# EasyEDA schematic SCH_OPLL+PSG MegaMod_2021-11-04.json

## Sheets
1 OPLL: TITLE: Sheet_1; REV: 1.0; Date: 2021-10-31; Sheet: 1/1; Drawn By: Denjhang; Company: Your Company
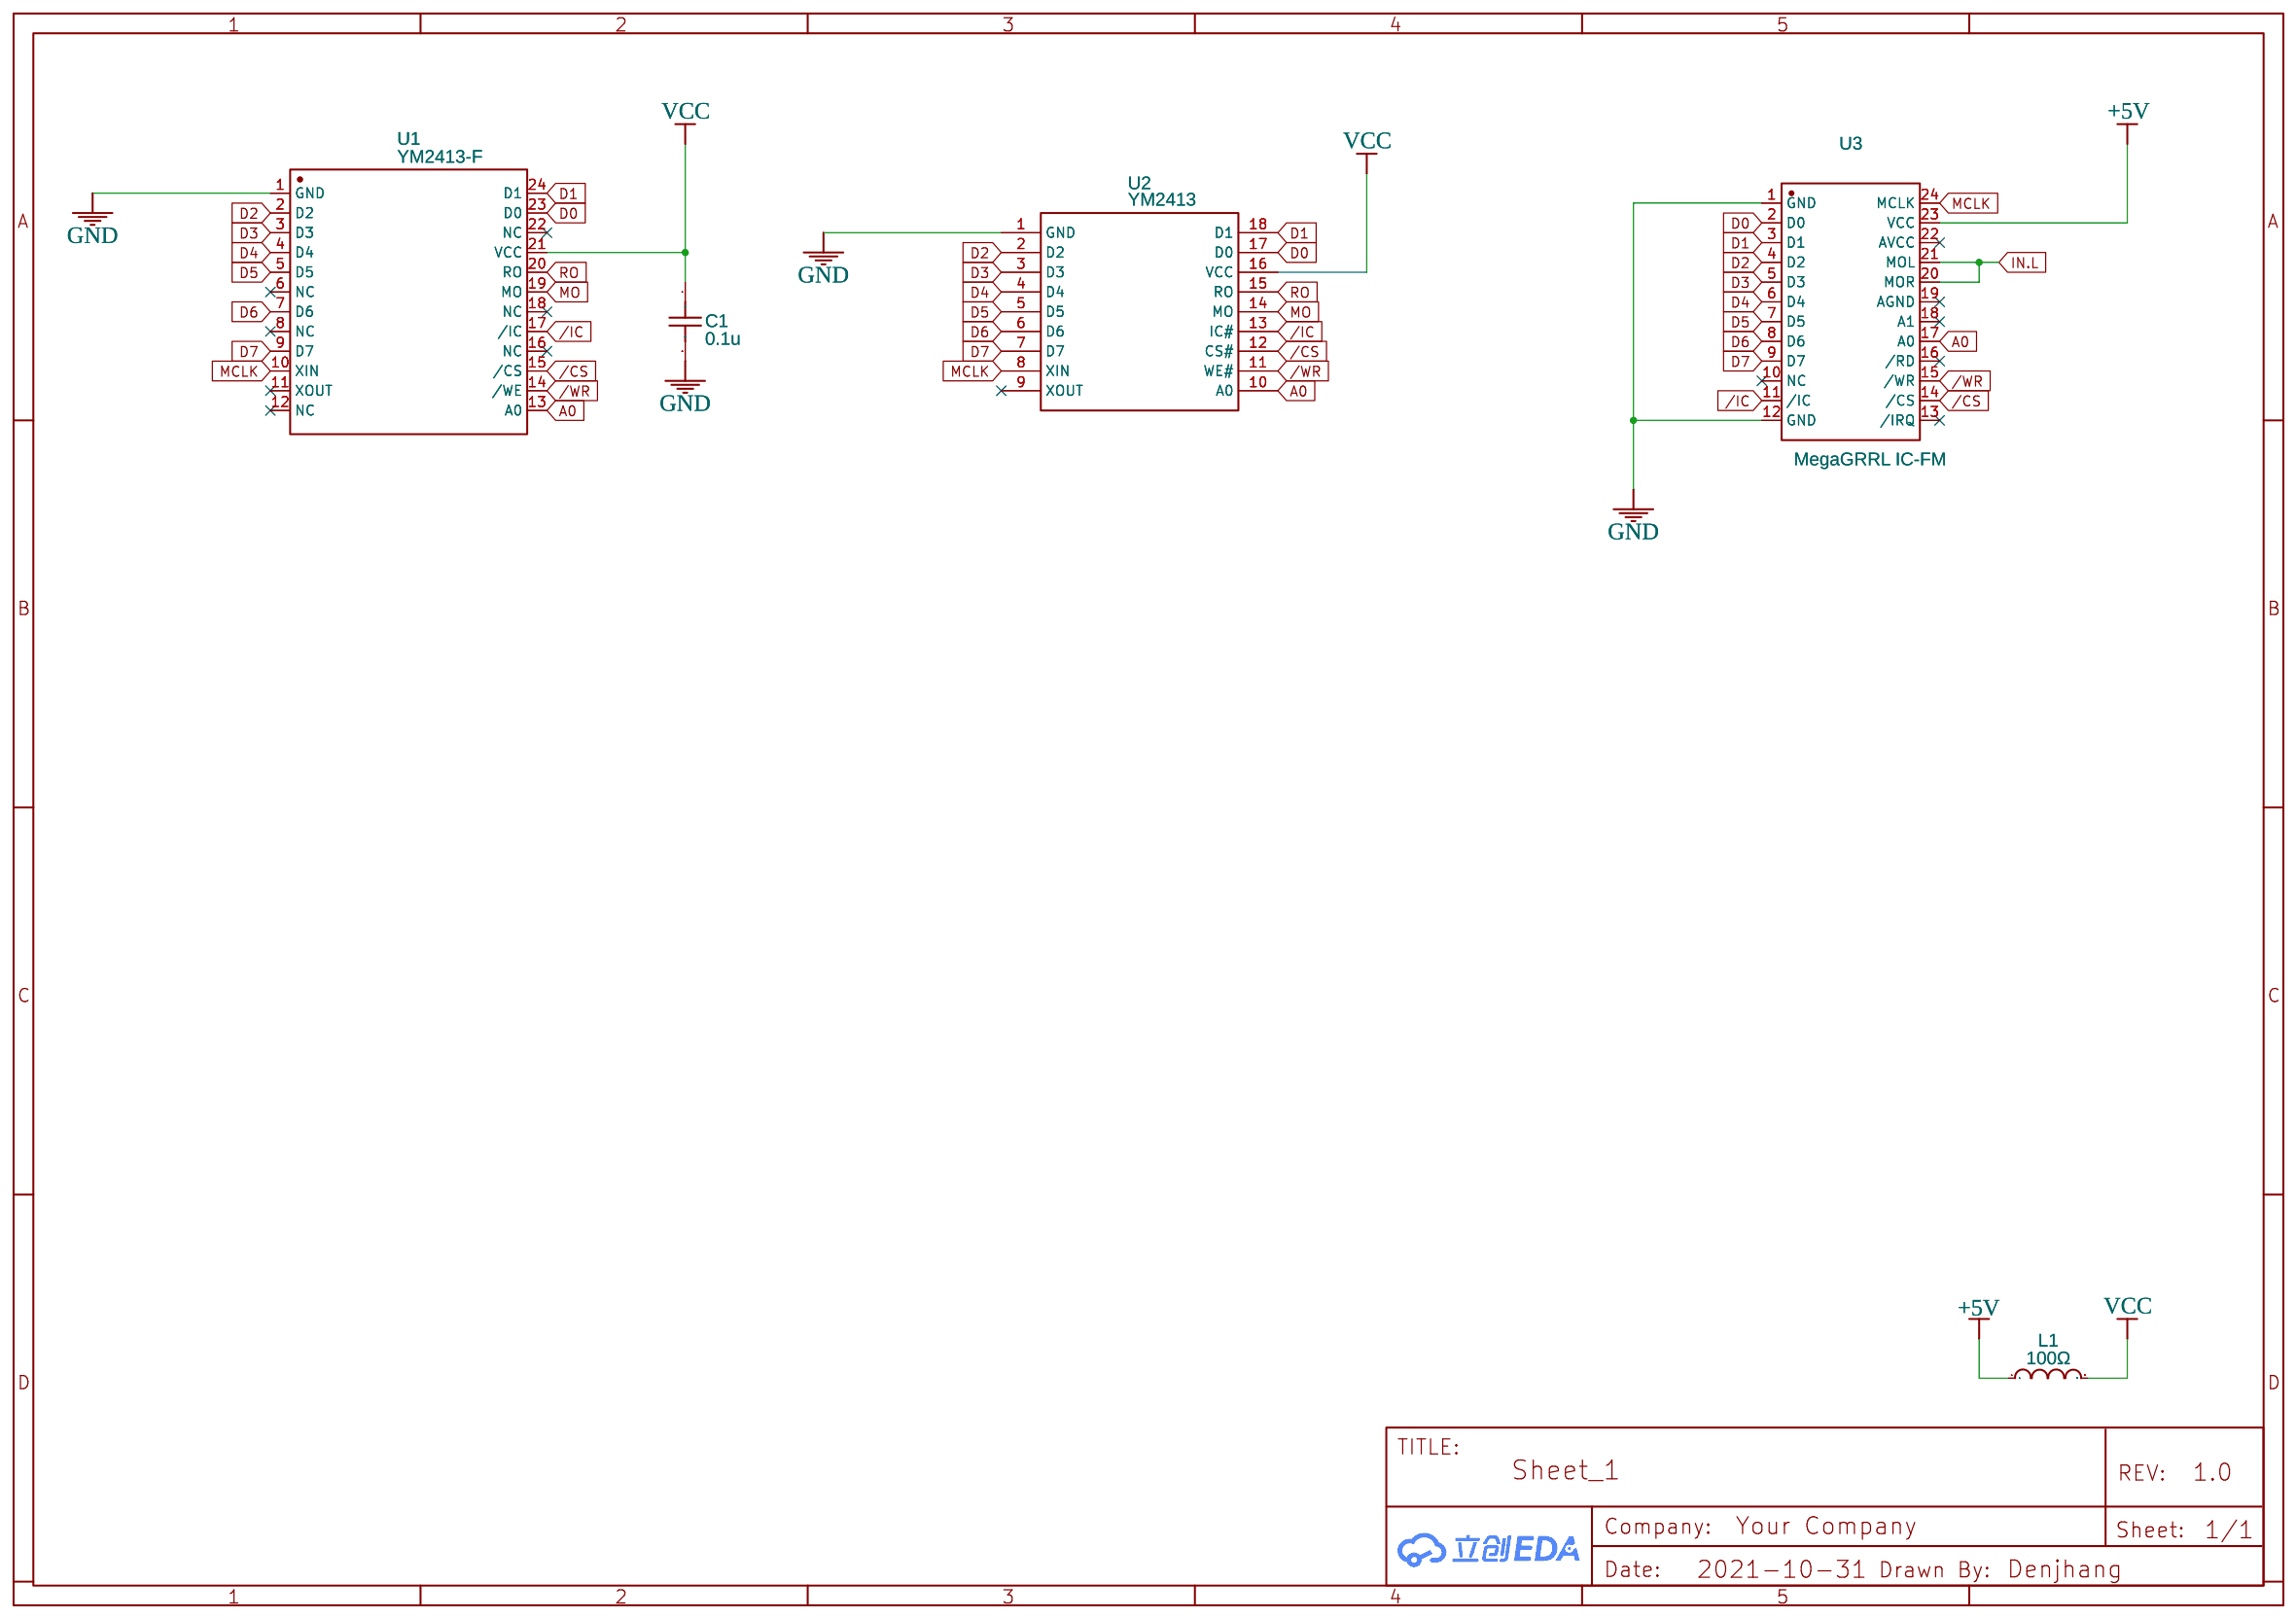
[diagram p0: OPLL]
2 PSG
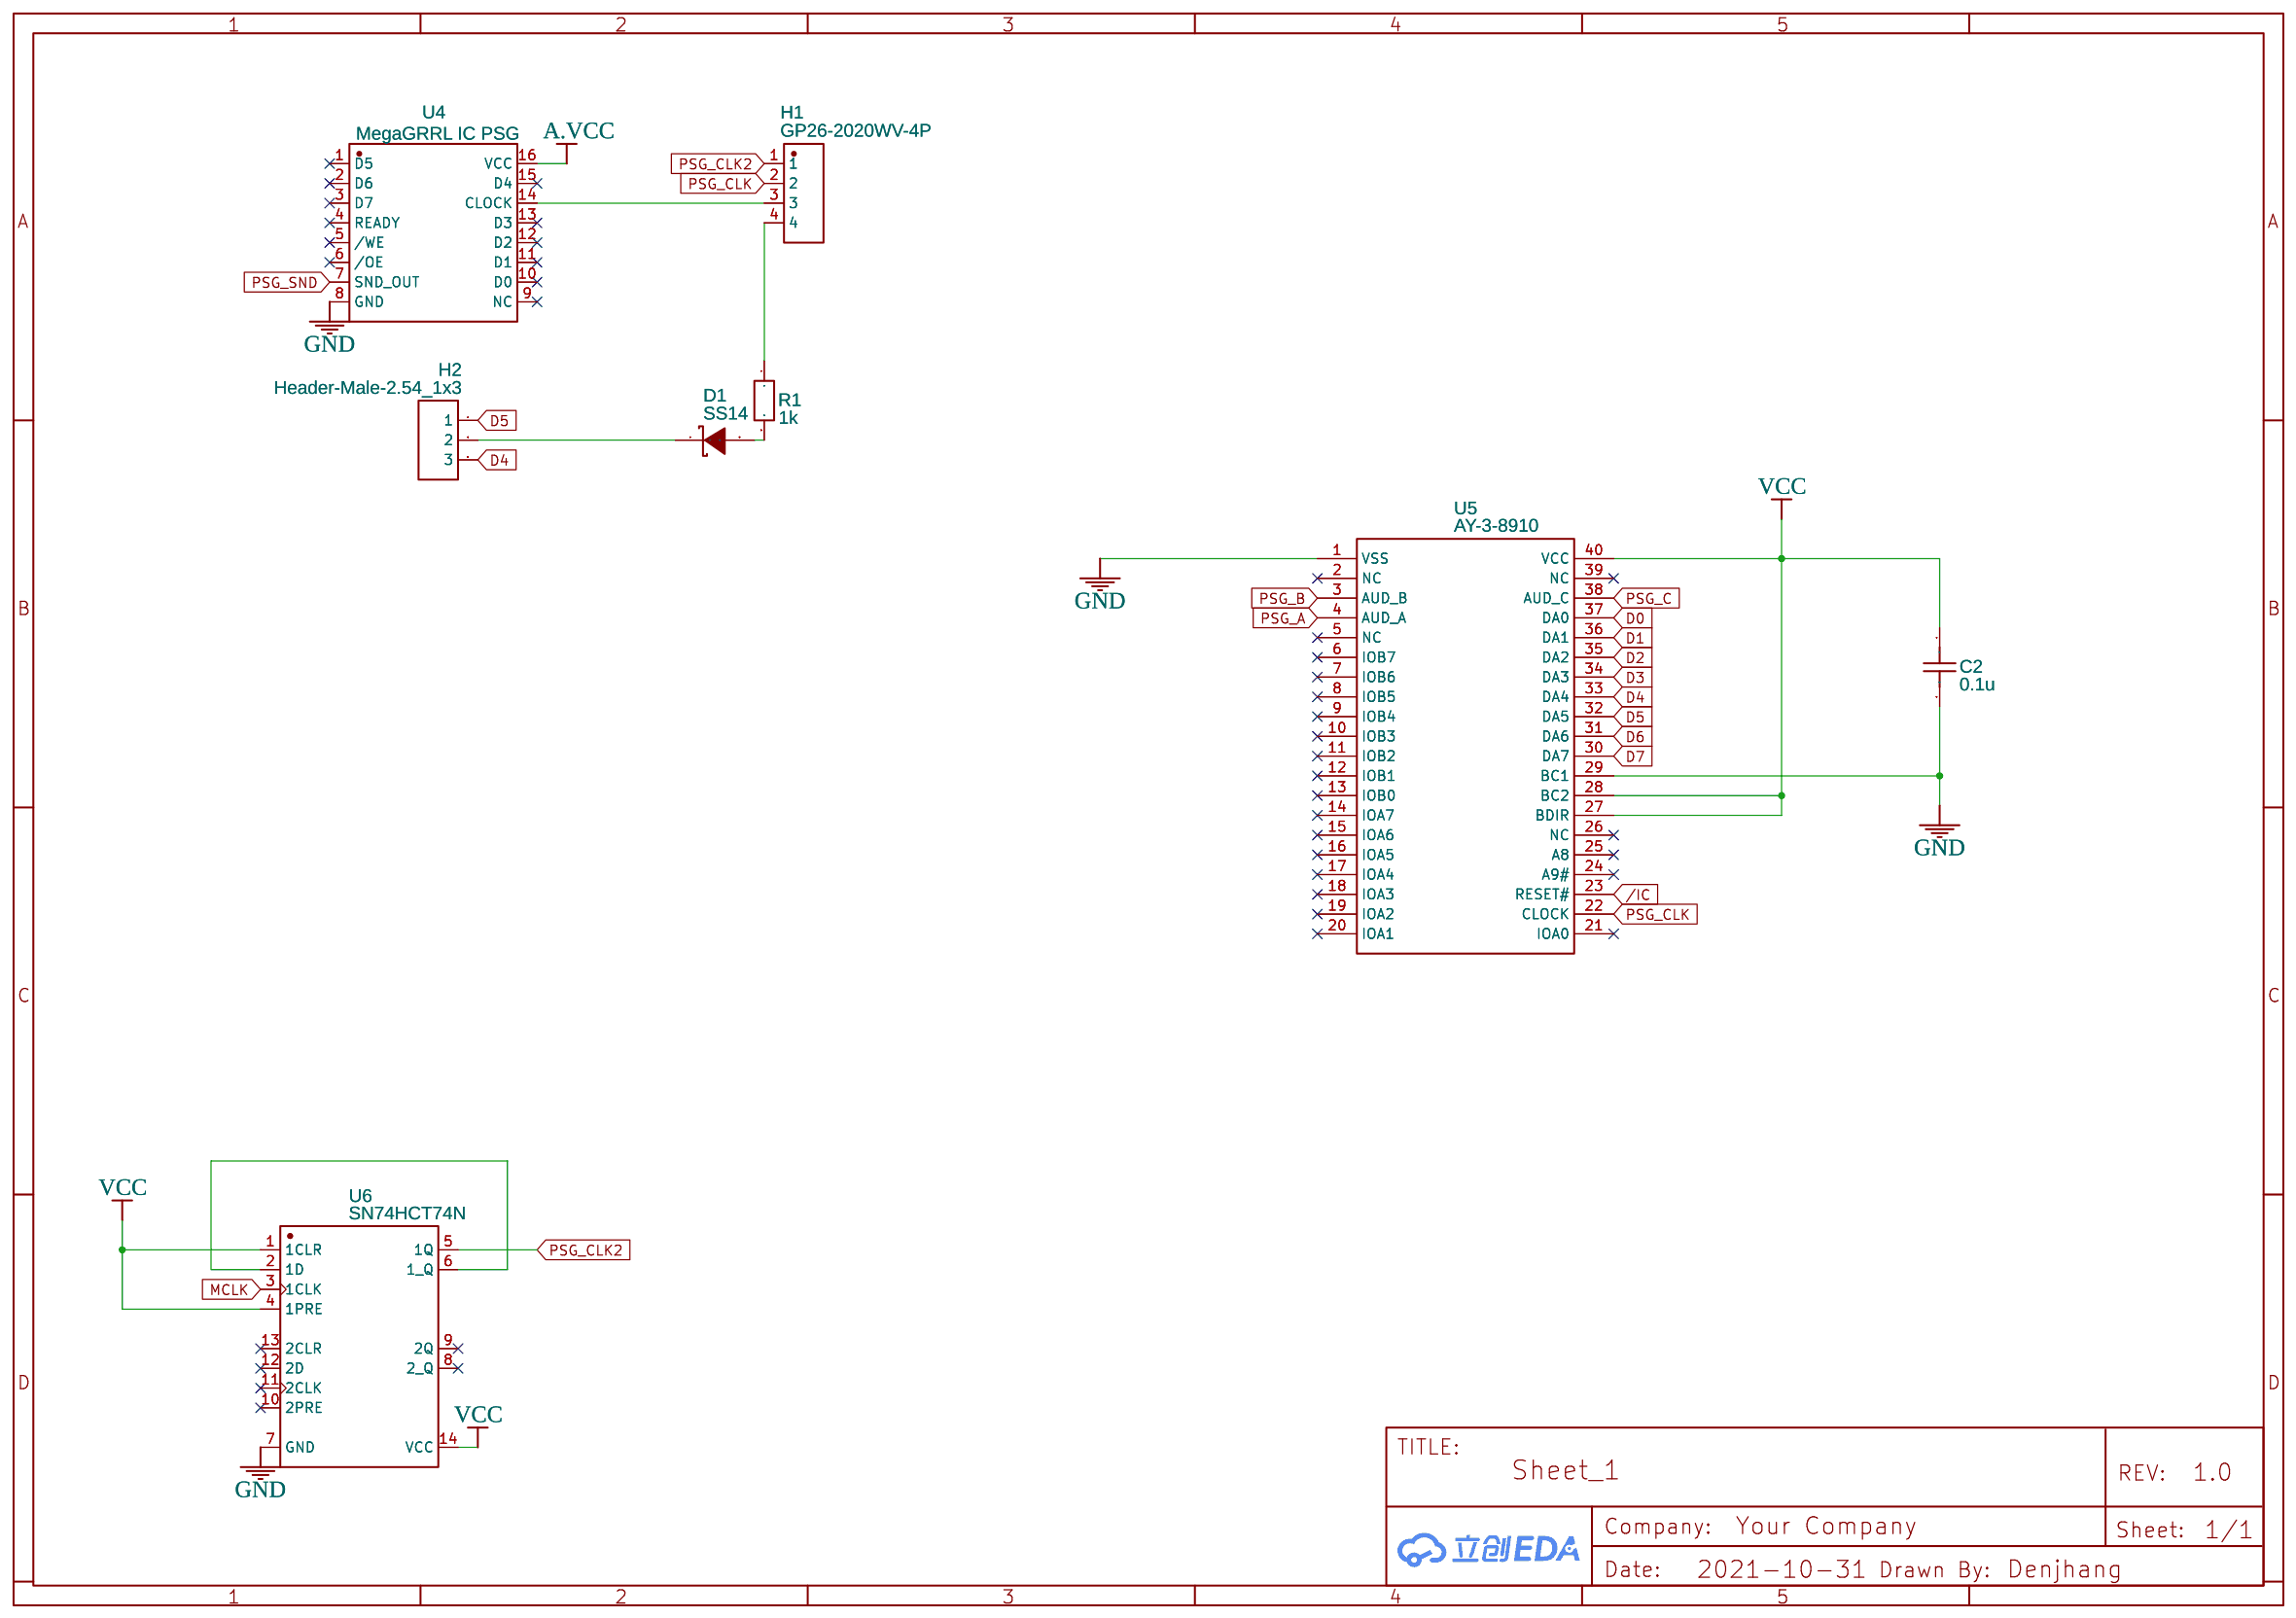
[diagram p1: PSG]
3 AY-Stereo: Date: 2021-11-02
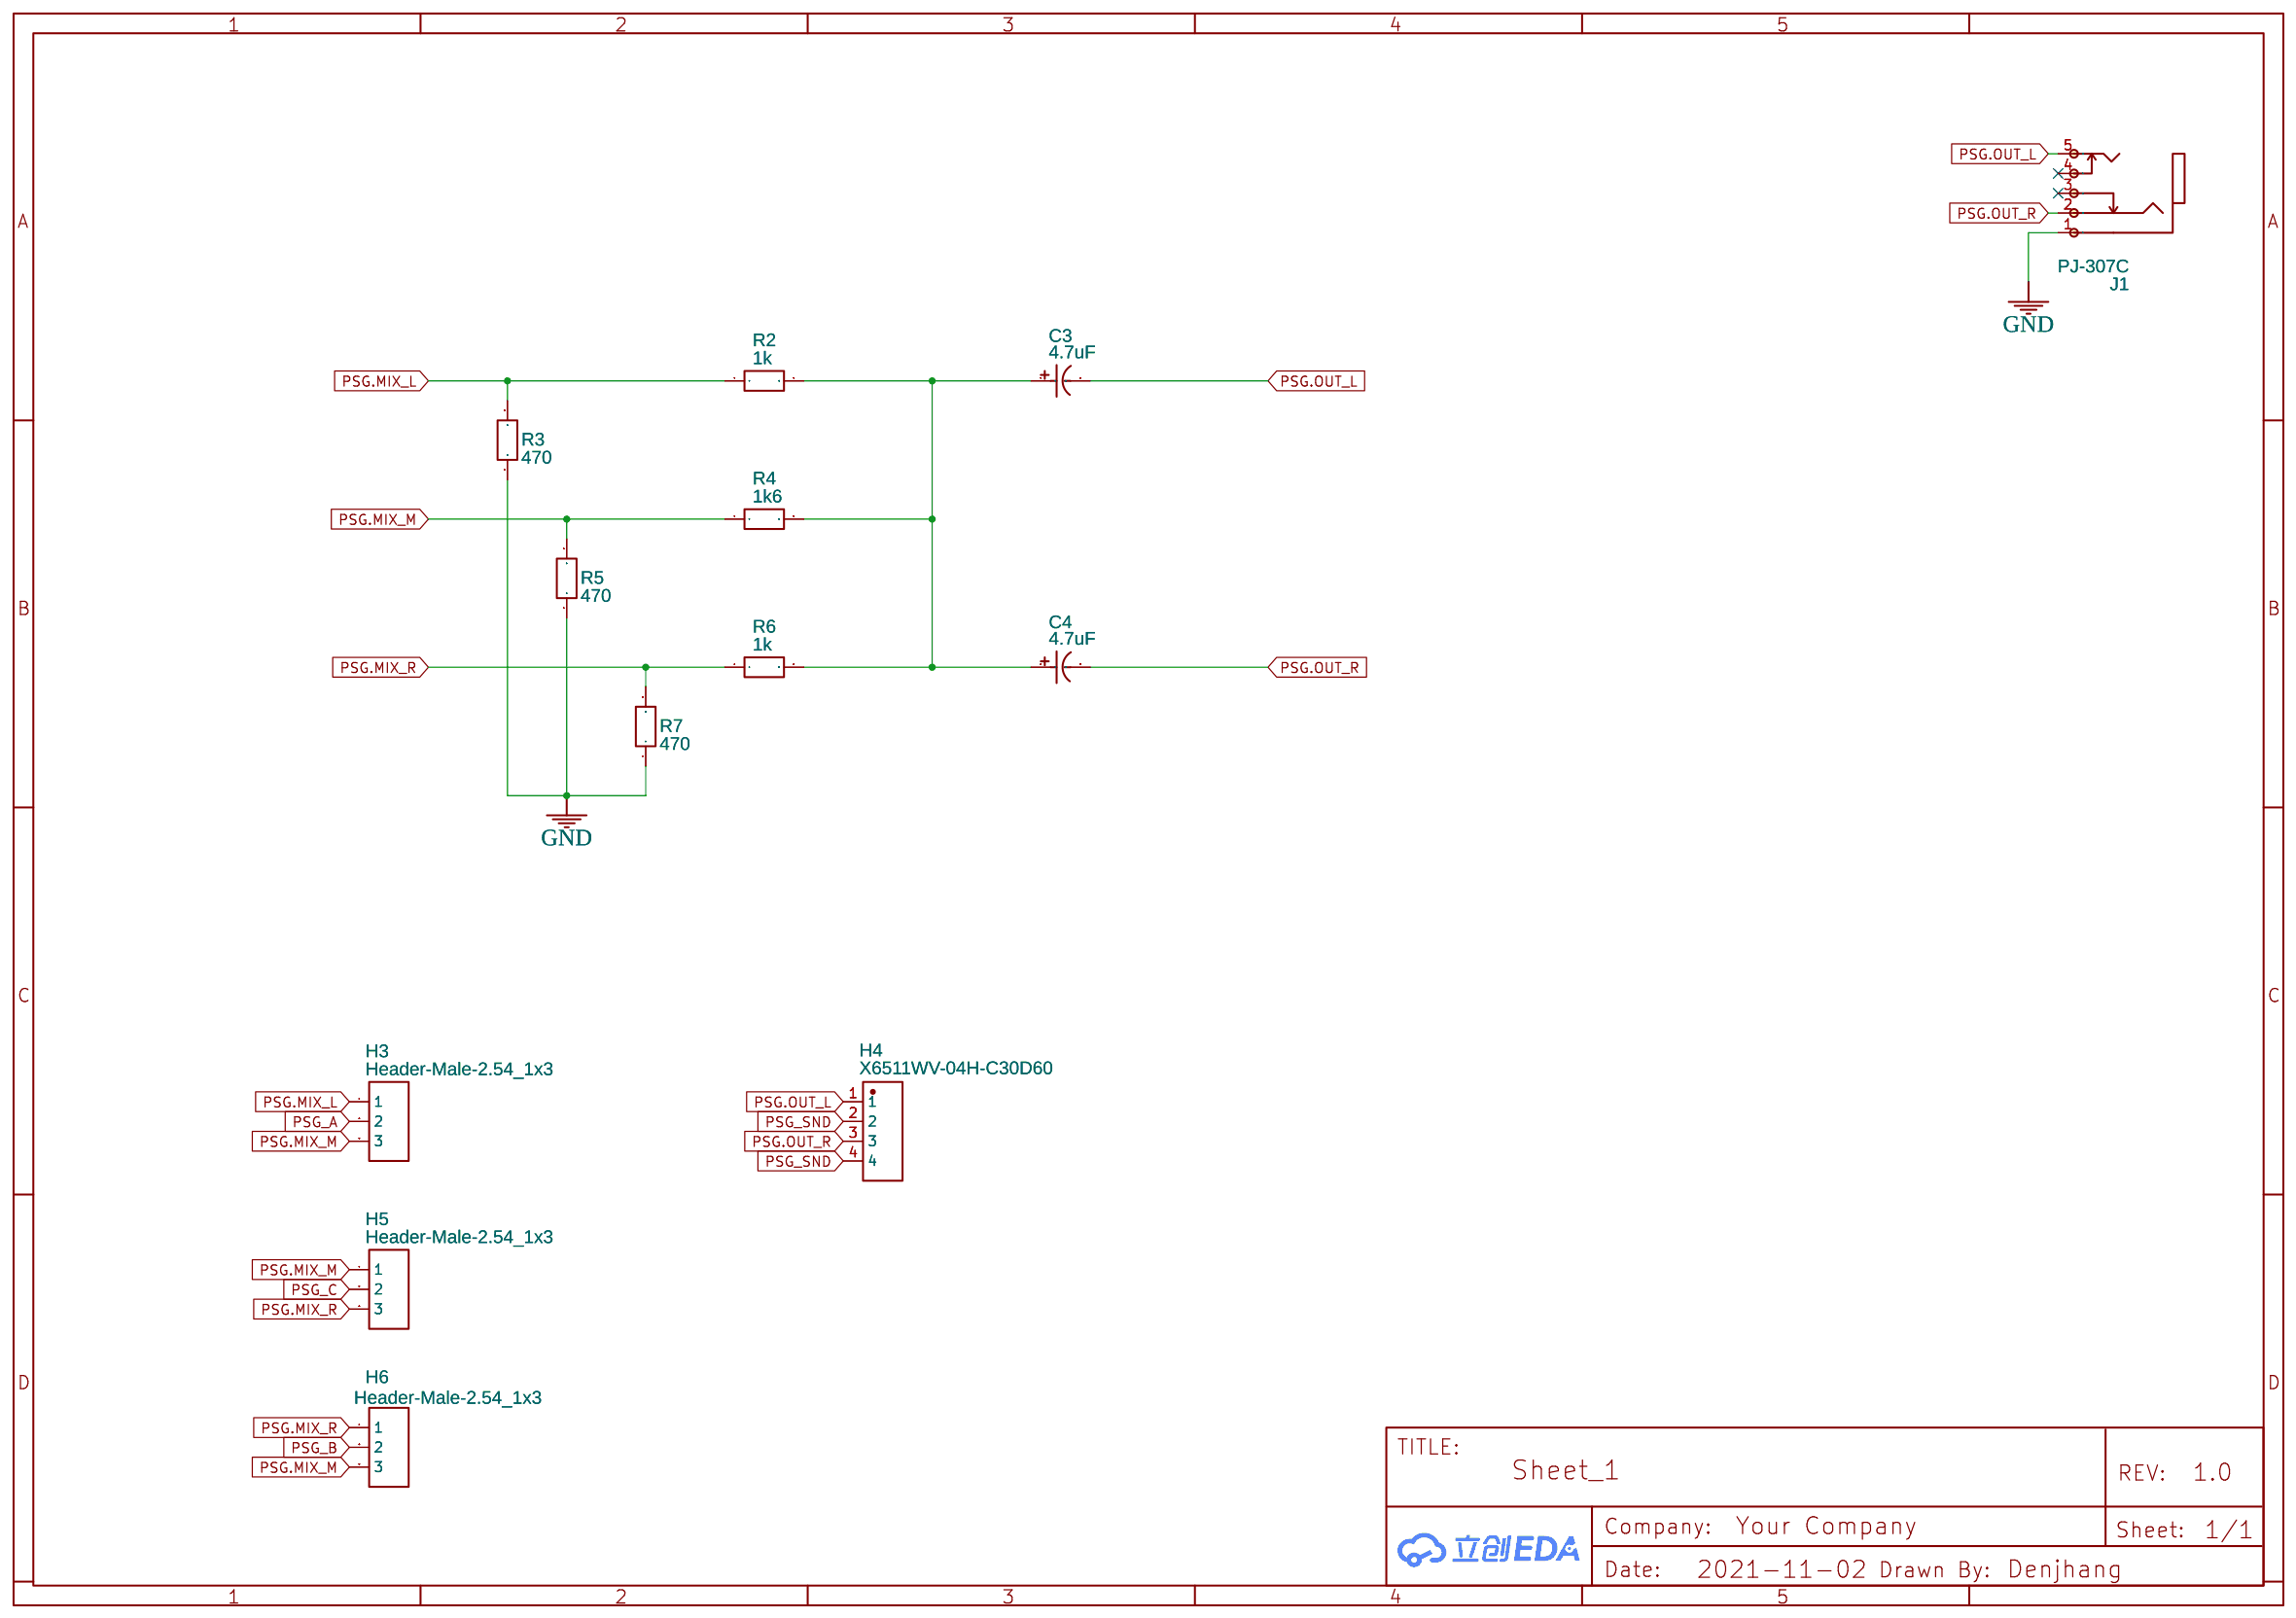
[diagram p2: AY-Stereo]
4 FM_AMP: Date: 2021-11-04
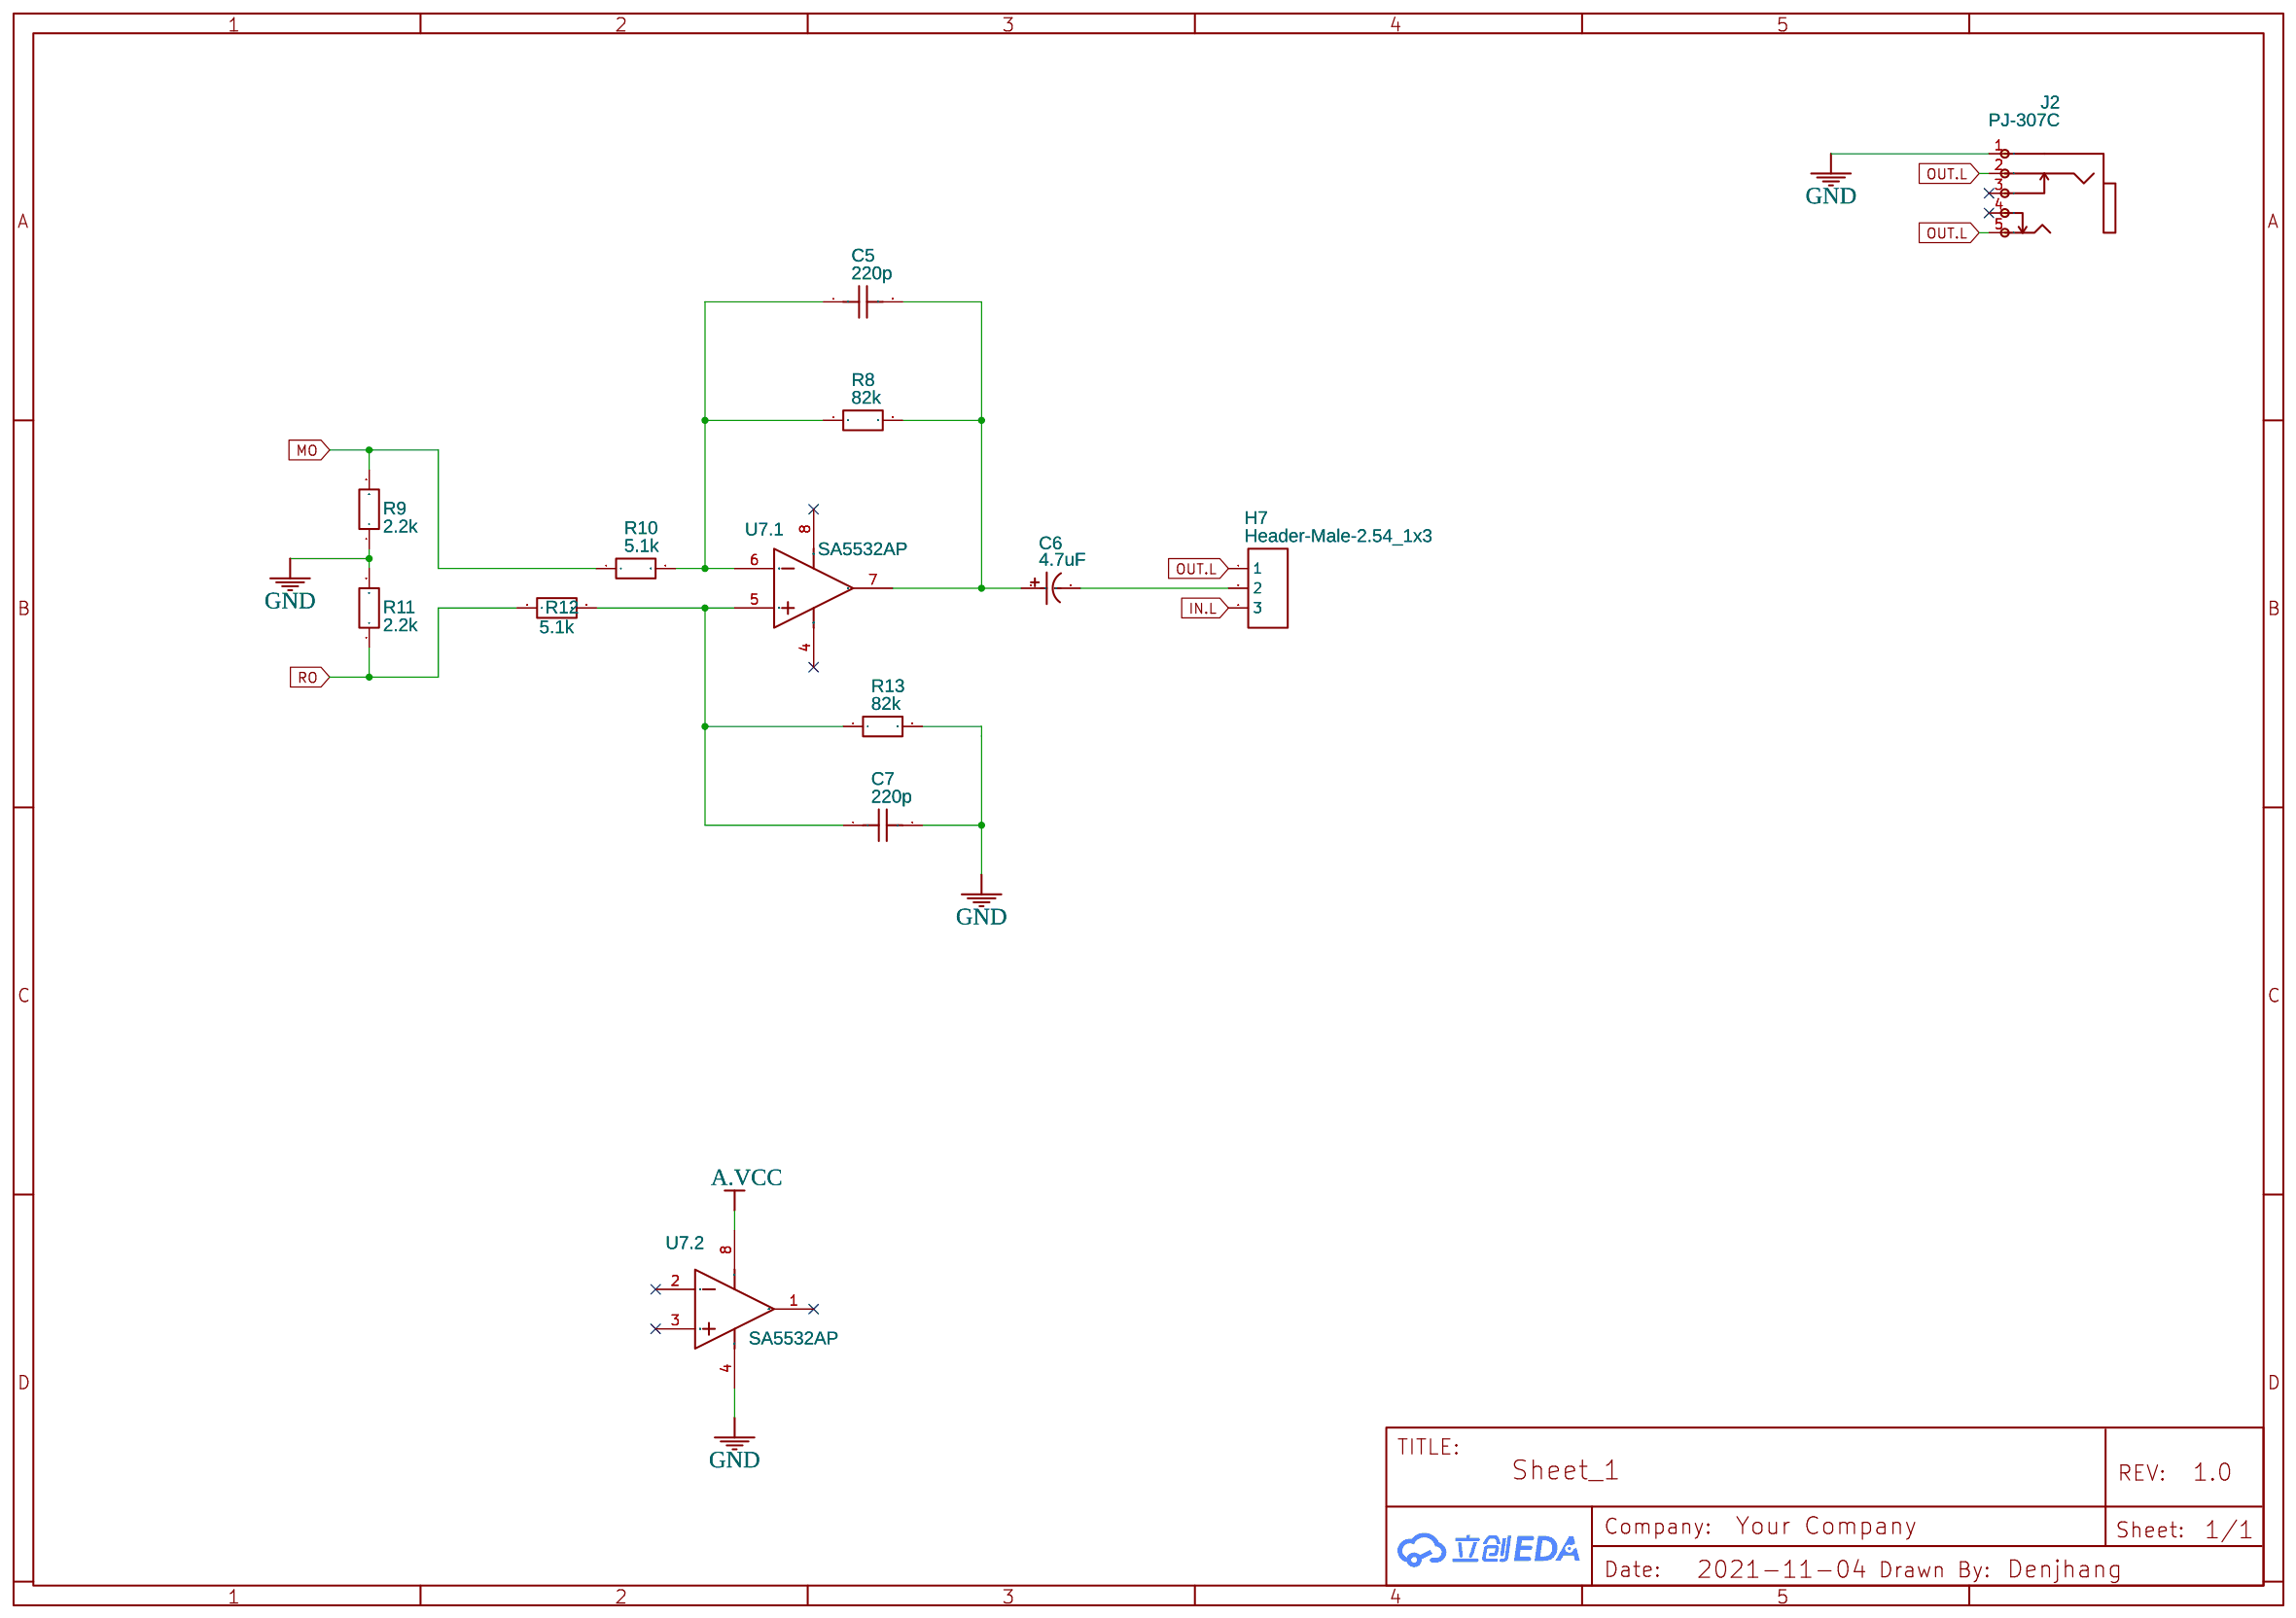
[diagram p3: FM_AMP]

## Parts
sheet AY-Stereo
C3  4.7uF  [CAP-TH_BD6.3-P2.50-D1.0-FD]
C4  4.7uF  [CAP-TH_BD6.3-P2.50-D1.0-FD]
H3  Header-Male-2.54_1x3  [HDR-TH_3P-P2.54-V-M-1]
H4  X6511WV-04H-C30D60  [HDR-TH_4P-P2.54-V-M]
H5  Header-Male-2.54_1x3  [HDR-TH_3P-P2.54-V-M-1]
H6  Header-Male-2.54_1x3  [HDR-TH_3P-P2.54-V-M-1]
J1  PJ-307C  [AUDIO-TH_PJ307C]
R2  1k  [R0603]
R3  470  [R0603]
R4  1k6  [R0603]
R5  470  [R0603]
R6  1k  [R0603]
R7  470  [R0603]
sheet FM_AMP
C5  220p  [C0603]
C6  4.7uF  [CAP-TH_BD6.3-P2.50-D1.0-FD]
C7  220p  [C0603]
H7  Header-Male-2.54_1x3  [HDR-TH_3P-P2.54-V-M-1]
J2  PJ-307C  [AUDIO-TH_PJ307C]
R8  82k  [R0603]
R9  2.2k  [R0603]
R10  5.1k  [R0603]
R11  2.2k  [R0603]
R12  5.1k  [R0603]
R13  82k  [R0603]
U7  SA5532AP  [DIP8]  (sections 1,2)
sheet OPLL
C1  0.1u  [C0603]
L1  100Ω  [L0603]
U1  YM2413-F  [SOIC24-YMF276]
U2  YM2413  [DIP-18_L23.0-W6.5-P2.54-LS7.6-BL]
U3  MegaGRRL IC-FM  [DIP-24_L32.0-W13.8-P2.54-LS15.6-BL]
sheet PSG
C2  0.1u  [C0603]
D1  SS14  [SMA_L4.4-W2.8-LS5.4-RD]
H1  GP26-2020WV-4P  [HDR-TH_4P-P2.00-V-M]
H2  Header-Male-2.54_1x3  [HDR-TH_3P-P2.54-V-M-1]
R1  1k  [R0603]
U4  MegaGRRL IC PSG  [DIP-16_L20.3-W10.2-P2.54-LS10.2-BL]
U5  AY-3-8910  [DIP-40_L52.0-W13.7-P2.54-LS15.2-BL]
U6  SN74HCT74N  [DIP-14]

## Library data of the parts
C3 C4 C6 = 25V 47uF: Supplier: LCSC; Manufacturer: ValuePro; Manufacturer Part: 电解电容25V 47uF; Supplier Part: C45704; JLCPCB Part Class: Extended Part
H2 H3 H5-H7 = Header-Male-2.54_1x3: Supplier: LCSC; Manufacturer: BOOMELE; Manufacturer Part: Header2.54mm 1*3P; Supplier Part: C49257; JLCPCB Part Class: Extended Part
H4 = X6511WV-04H-C30D60: Supplier: LCSC; Supplier Part: C706876; Manufacturer: XKB Connectivity; Contributor: LCSC; JLCPCB Part Class: Extended Part
J1 J2 = PJ-307C: Supplier: LCSC; Manufacturer: BOOMELE; Supplier Part: C16684; JLCPCB Part Class: Extended Part
R1-R13 = R_0603_EU: Contributor: LCEDA_Lib
C1 C2 C5 C7 = C_0603_US: Contributor: LCEDA_Lib
U7 = SA5532AP: Dual Low-Noise Operational Amplifier, 10 to 30 V, -40 to 85 degC, 8-pin DIP (P8), Pb-Free (RoHS); subpart_no: 1
L1 = CBW160808U102T: Supplier: LCSC; Manufacturer: FH; Supplier Part: C50069; JLCPCB Part Class: Extended Part
U1 = YM2413-F: Contributor: Denjhang
U2 = YM2413: Manufacturer: YAMAHA; Contributor: SudoMaker
U3 = MegaGRRL IC-FM: Supplier Part: C707077; Manufacturer: YAMAHA; Manufacturer Part: YM2612; Contributor: Denjhang; JLCPCB SMD: Yes; SMT Type: Extend
D1 = SS14: Supplier: LCSC; Manufacturer: MDD; Supplier Part: C2480; JLCPCB Part Class: Basic Part
H1 = GP26-2020WV-4P: Supplier: LCSC; Supplier Part: C2681736; Manufacturer: GEPU(歌普); Contributor: LCSC; JLCPCB Part Class: Extended Part
U4 = MegaGRRL IC PSG: Supplier: LCSC; Supplier Part: C157594; Manufacturer: Nextronics Engineering; Manufacturer Part: Z-10016320100100; Contributor: Denjhang; JLCPCB SMD: Yes; SMT Type: Extend
U5 = AY-3-8910: Manufacturer: Microchip; Contributor: SudoMaker
U6 = SN74HCT74N

## Nets
+5V: L1.1 U3.23(VCC)
GND: C1.2 C2.2 C7.2 J1.1 J2.1 R3.1 R5.1 R7.1 R9.1 R11.2 R13.2 U1.1(GND) U2.1(GND) U3.1(GND) U3.12(GND) U4.8(GND) U5.1(VSS) U5.29(BC1) U6.7(GND) U7.4(VCC-)
VCC: C1.1 C2.1 L1.2 U1.21(VCC) U2.16(VCC) U5.27(BDIR) U5.28(BC2) U5.40(VCC) U6.1(1CLR) U6.4(1PRE) U6.14(VCC)
/CS: U1.15(/CS) U2.12(CS#) U3.14(/CS)
/IC: U1.17(/IC) U2.13(IC#) U3.11(/IC) U5.23(RESET#)
/WR: U1.14(/WE) U2.11(WE#) U3.15(/WR)
A0: U1.13(A0) U2.10(A0) U3.17(A0)
A.VCC: U4.16(VCC) U7.8(VCC+)
D0: U1.23(D0) U2.17(D0) U3.2(D0) U5.37(DA0)
D1: U1.24(D1) U2.18(D1) U3.3(D1) U5.36(DA1)
D2: U1.2(D2) U2.2(D2) U3.4(D2) U5.35(DA2)
D3: U1.3(D3) U2.3(D3) U3.5(D3) U5.34(DA3)
D4: H2.3 U1.4(D4) U2.4(D4) U3.6(D4) U5.33(DA4)
D5: H2.1 U1.5(D5) U2.5(D5) U3.7(D5) U5.32(DA5)
D6: U1.7(D6) U2.6(D6) U3.8(D6) U5.31(DA6)
D7: U1.9(D7) U2.7(D7) U3.9(D7) U5.30(DA7)
IN.L: H7.3 U3.20(MOR) U3.21(MOL)
MCLK: U1.10(XIN) U2.8(XIN) U3.24(MCLK) U6.3(1CLK)
MO: R9.2 R10.1 U1.19(MO) U2.14(MO)
OUT.L: H7.1 J2.2 J2.5
PSG.MIX_L: H3.1 R2.1 R3.2
PSG.MIX_M: H3.3 H5.1 H6.3 R4.1 R5.2
PSG.MIX_R: H5.3 H6.1 R6.1 R7.2
PSG.OUT_L: C3.2 H4.1 J1.5
PSG.OUT_R: C4.2 H4.3 J1.2
PSG_A: H3.2 U5.4(AUD_A)
PSG_B: H6.2 U5.3(AUD_B)
PSG_C: H5.2 U5.38(AUD_C)
PSG_CLK: H1.2 U5.22(CLOCK)
PSG_CLK2: H1.1 U6.5(1Q)
PSG_SND: H4.2 H4.4 U4.7(SND_OUT)
RO: R11.1 R12.1 U1.20(RO) U2.15(RO)
Net-(C3-1): C3.1 C4.1 R2.2 R4.2 R6.2
Net-(C5-1): C5.1 R8.1 R10.2 U7.6(IN2-)
Net-(C5-2): C5.2 C6.1 R8.2 U7.7(OUT2)
Net-(C6-2): C6.2 H7.2
Net-(C7-1): C7.1 R12.2 R13.1 U7.5(IN2+)
Net-(D1-1): D1.1(K) H2.2
Net-(D1-2): D1.2(A) R1.2
Net-(H1-3): H1.3 U4.14(CLOCK)
Net-(H1-4): H1.4 R1.1
Net-(U6-2): U6.2(1D) U6.6(1_Q)

Not connected (* = marked no-connect by the designer): J1 3* 4*; J2 3* 4*; U1 6(NC)* 8(NC)* 11(XOUT)* 12(NC)* 16(NC)* 18(NC)* 22(NC)*; U2 9(XOUT)*; U3 10(NC)* 13(/IRQ)* 16(/RD)* 18(A1)* 19(AGND)* 22(AVCC)*; U4 1(D5)* 2(D6)* 3(D7)* 4(READY)* 5(/WE)* 6(/OE)* 9(NC)* 10(D0)* 11(D1)* 12(D2)* 13(D3)* 15(D4)*; U5 2(NC)* 5(NC)* 6(IOB7)* 7(IOB6)* 8(IOB5)* 9(IOB4)* 10(IOB3)* 11(IOB2)* 12(IOB1)* 13(IOB0)* 14(IOA7)* 15(IOA6)* 16(IOA5)* 17(IOA4)* 18(IOA3)* 19(IOA2)* 20(IOA1)* 21(IOA0)* 24(A9#)* 25(A8)* 26(NC)* 39(NC)*; U6 8(2_Q)* 9(2Q)* 10(2PRE)* 11(2CLK)* 12(2D)* 13(2CLR)*; U7 1(OUT1)* 2(IN1-)* 3(IN1+)*
